# Altium project DVT-Atlas-Driver.PrjPcb
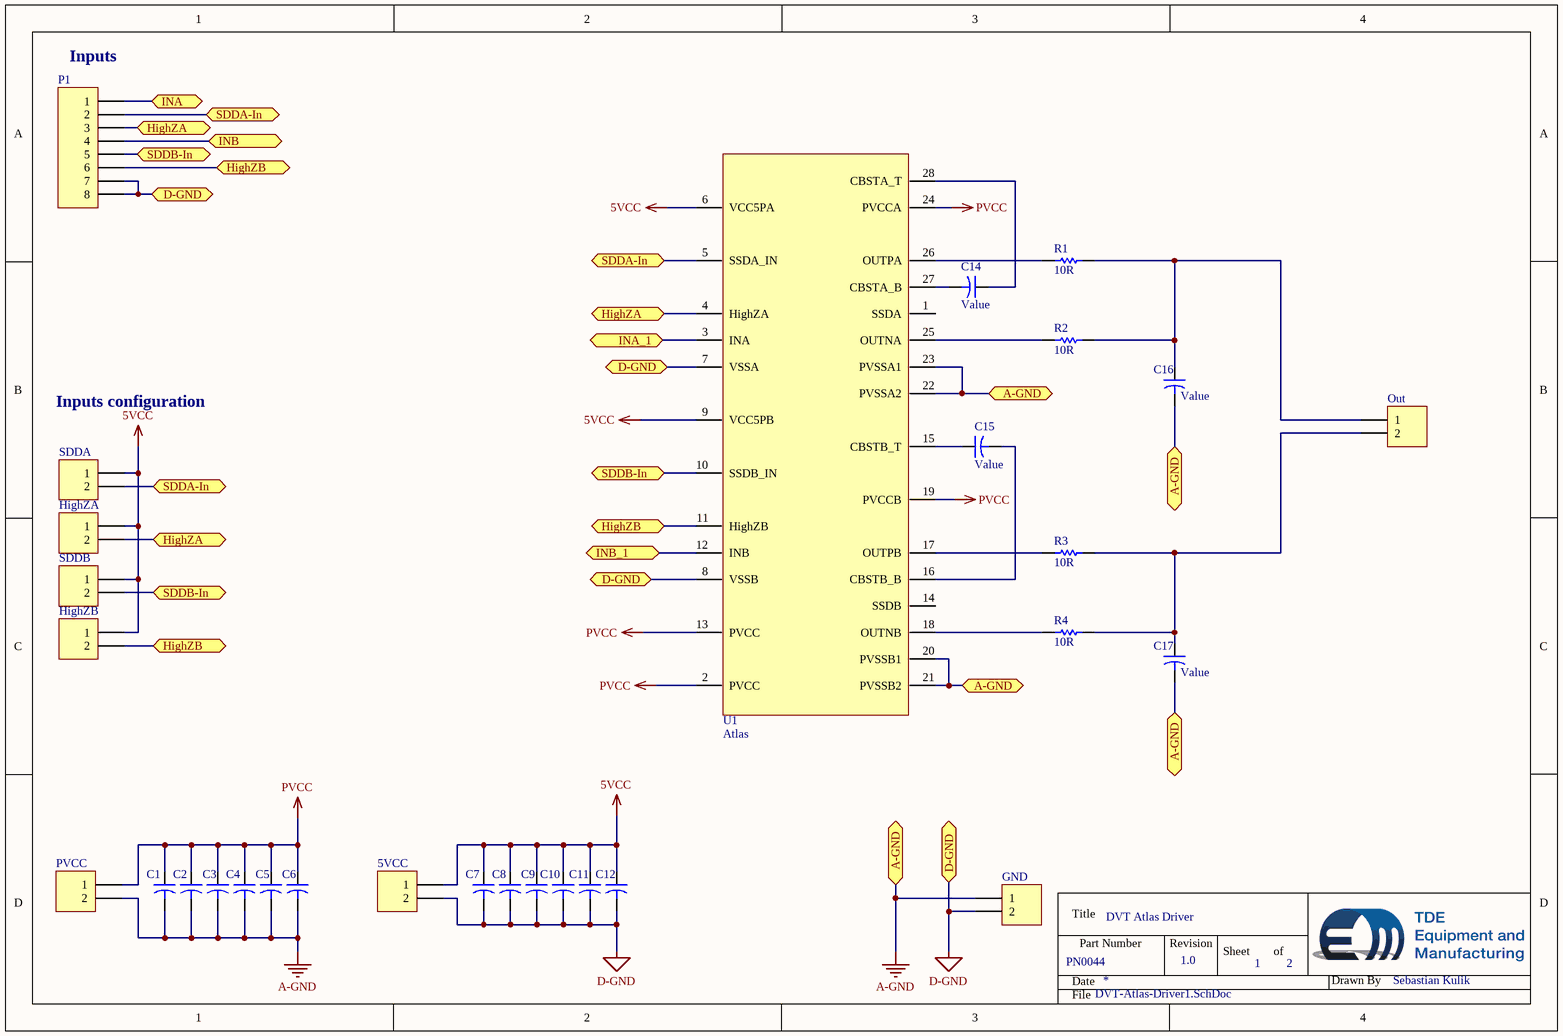
[diagram p0: DVT-Atlas-Driver1.SchDoc]
2 sheets, 36 parts. Net scope: flat (ports and power ports of the same name join across sheets).
Board file: DVT-Atlas-Driver.PcbDoc
Sheets:
  DVT-Atlas-Driver1.SchDoc
  DVT-Atlas-Driver2.SchDoc

## Sheet DVT-Atlas-Driver1.SchDoc: DVT Atlas Driver
size A4; PartNumber: PN0044; Drawn By: Sebastian Kulik

### Parts
5VCC  PHOENIX_1715721  [Phoenix-2-5_08]  (value not drawn)
*  Om  [Om-5mm]  (value not drawn)
+  Om  [Om-5mm]  (value not drawn)
C1  Capacitor-Dummy-THT  [Dummy-10mm]  (value not drawn)
C2  Capacitor-Dummy-THT  [KEMET-C052H]  (value not drawn)
C3  Capacitor-Dummy-THT  [KEMET-C052H]  (value not drawn)
C4  Capacitor-Dummy-THT  [KEMET-C052H]  (value not drawn)
C5  Capacitor-Dummy-THT  [KEMET-C052H]  (value not drawn)
C6  Capacitor-Dummy-THT  [KEMET-C052H]  (value not drawn)
C7  Capacitor-Dummy-THT  [KEMET-C052H]  (value not drawn)
C8  Capacitor-Dummy-THT  [Dummy-10mm]  (value not drawn)
C9  Capacitor-Dummy-THT  [KEMET-C052H]  (value not drawn)
C10  Capacitor-Dummy-THT  [KEMET-C052H]  (value not drawn)
C11  Capacitor-Dummy-THT  [KEMET-C052H]  (value not drawn)
C12  Capacitor-Dummy-THT  [KEMET-C052H]  (value not drawn)
C14  Capacitor-Dummy-THT  [KEMET-C052H]  (value not drawn)
C15  Capacitor-Dummy-THT  [KEMET-C052H]  (value not drawn)
C16  Capacitor-Dummy-THT  [KEMET-C052H]  (value not drawn)
C17  Capacitor-Dummy-THT  [KEMET-C052H]  (value not drawn)
GND  PHOENIX_1715721  [Phoenix-2-5_08]  (value not drawn)
HighZA  Plug_2_180_2.54  [HDR1X2]  (value not drawn)
HighZB  Plug_2_180_2.54  [HDR1X2]  (value not drawn)
Out  PHOENIX_1715721  [Phoenix-2-5_08]  (value not drawn)
P1  Plug_08_2.54  [HDR1X8_2.54]  (value not drawn)
PVCC  PHOENIX_1715721  [Phoenix-2-5_08]  (value not drawn)
R1  value 10R  [Dummy-10mm]  (hidden comment: 10R_10mm-HT-THT)
R2  value 10R  [Dummy-10mm]  (hidden comment: 10R_10mm-HT-THT)
R3  value 10R  [Dummy-10mm]  (hidden comment: 10R_10mm-HT-THT)
R4  value 10R  [Dummy-10mm]  (hidden comment: 10R_10mm-HT-THT)
SDDA  Plug_2_180_2.54  [HDR1X2]  (value not drawn)
SDDB  Plug_2_180_2.54  [HDR1X2]  (value not drawn)
U1  Atlas  [SOIC28]

### Ports
A-GND, D-GND, HighZA, HighZB, INA, INA_1, INB, INB_1, SDDA-In, SDDB-In

### Nets
5VCC: 5VCC.1 C7.1 C8.1 C9.1 C10.1 C11.1 C12.1 HighZA.1 HighZB.1 SDDA.1 SDDB.1 U1.6(VCC5PA) U1.9(VCC5PB)
A-GND: C1.2 C2.2 C3.2 C4.2 C5.2 C6.2 C16.2 C17.2 GND.1 PVCC.2 U1.20(PVSSB1) U1.21(PVSSB2) U1.22(PVSSA2) U1.23(PVSSA1) ; port A-GND
D-GND: 5VCC.2 C7.2 C8.2 C9.2 C10.2 C11.2 C12.2 GND.2 P1.7 P1.8 U1.7(VSSA) U1.8(VSSB) ; port D-GND
PVCC: C1.1 C2.1 C3.1 C4.1 C5.1 C6.1 PVCC.1 U1.2(PVCC) U1.13(PVCC) U1.19(PVCCB) U1.24(PVCCA)
NetC14_1: C14.1 U1.28(CBSTA_T)
NetC14_2: C14.2 U1.27(CBSTA_B)
NetC15_1: C15.1 U1.15(CBSTB_T)
NetC15_2: C15.2 U1.16(CBSTB_B)
NetC16_1: C16.1 Out.1 R1.2 R2.2
NetC17_1: C17.1 Out.2 R3.2 R4.2
NetHighZA_2: HighZA.2 P1.3 U1.4(HighZA) ; port HighZA
NetHighZB_2: HighZB.2 P1.6 U1.11(HighZB) ; port HighZB
NetINA_1: P1.1 ; port INA
NetINA_2: U1.3(INA) ; port INA_1
NetINB_1: P1.4 ; port INB
NetINB_2: U1.12(INB) ; port INB_1
NetP1_2: P1.2 SDDA.2 U1.5(SSDA_IN) ; port SDDA-In
NetP1_5: P1.5 SDDB.2 U1.10(SSDB_IN) ; port SDDB-In
NetR1_1: R1.1 U1.26(OUTPA)
NetR2_1: R2.1 U1.25(OUTNA)
NetR3_1: R3.1 U1.17(OUTPB)
NetR4_1: R4.1 U1.18(OUTNB)

Not connected (* = marked no-connect by the designer): U1 1(SSDA) 14(SSDB)

### Notes on the sheet
- (near P1) Inputs
- Inputs configuration
- 1.0
- 1
- 2
- Title
- Date
- Part Number
- Revision
- Sheet
- of
- Drawn By
- File

### Library data of the parts
5VCC GND Out PVCC = 2Pol_1715721: Phoenix, 2 pol, 5.08mm, 22A, 715721; Deliverer PartNr: 3041529; Deliverer: Farnell; TDE-PN: CON0008; LatestRevisionDate: 02.05.2014; LatestRevisionNote: Re-released for DXP Platform.; Publisher: Sebastian Kulik; Manufacturer PartNr: 1715721; Manufacturer: Phoenix; PackageDescription: Phoenix-2-5_08
HighZA HighZB SDDA SDDB = Plug_2_180_2.54: Plug, 2-Pin; Manufacturer PartNr: 61300211121; Manufacturer: WE; Deliverer PartNr: 828-1581; Deliverer: RS; TDE-PN: CON0010; LatestRevisionDate: 14.05.2014; LatestRevisionNote: Re-released for DXP Platform.; Publisher: Sebastian Kulik; Price: 0.118/5
P1 = Plug_08_2.54: Plug, 08-Pin; Manufacturer PartNr: 61300811121; Manufacturer: WE; Deliverer PartNr: 828-1604; Deliverer: RS; TDE-PN: CON0035; LatestRevisionDate: 11.11.2014; LatestRevisionNote: Re-released for DXP Platform.; Publisher: Sebastian Kulik; Price: 0.346/5
R1-R4 = 10R_10mm-HT-THT: Vishay RN60 series,175°C ,250mW, 1%; Manufacturer PartNr: RN60D10R0FB14; Deliverer PartNr: 830-7558; TDE-PN: R0080; Deliverer: RS; Published: 27.10.2014; Publisher: Sebastian Kulik; PackageDescription: 1206; Manufacturer: Vishay; Price: 0.11/1; Part Description: Vishay RN60 series,175°C ,250mW, 1%
U1 = CHT_TIT3345E_CSOIC28_T: Gate driver, 30V, HT; Deliverer PartNr: CHT-TIT3345E-CSOIC28-T; Manufacturer: CISSOID; Deliverer: Future; TDE-PN: IC0075; Published: 12.05.2016; PackageDescription: SOIC28; Publisher: Sebastian Kulik; Manufacturer PartNr: CHT-TIT3345E-CSOIC28-T; Price: 481.89
C1-C12 C14-C17 = Capacitor-Dummy-THT: Published: 08.12.2015; Part Description: Capacitor-Dummy-THT; Publisher: Sebastian Kulik; PackageDescription: -; Deliverer: -; Deliverer PartNr: -; Manufacturer: -; Manufacturer PartNr: -; TDE-PN: -; Value: Value; Price: *

## Sheet DVT-Atlas-Driver2.SchDoc: DVT Atlas Driver
size A4; PartNumber: PN0044; Drawn By: Sebastian Kulik
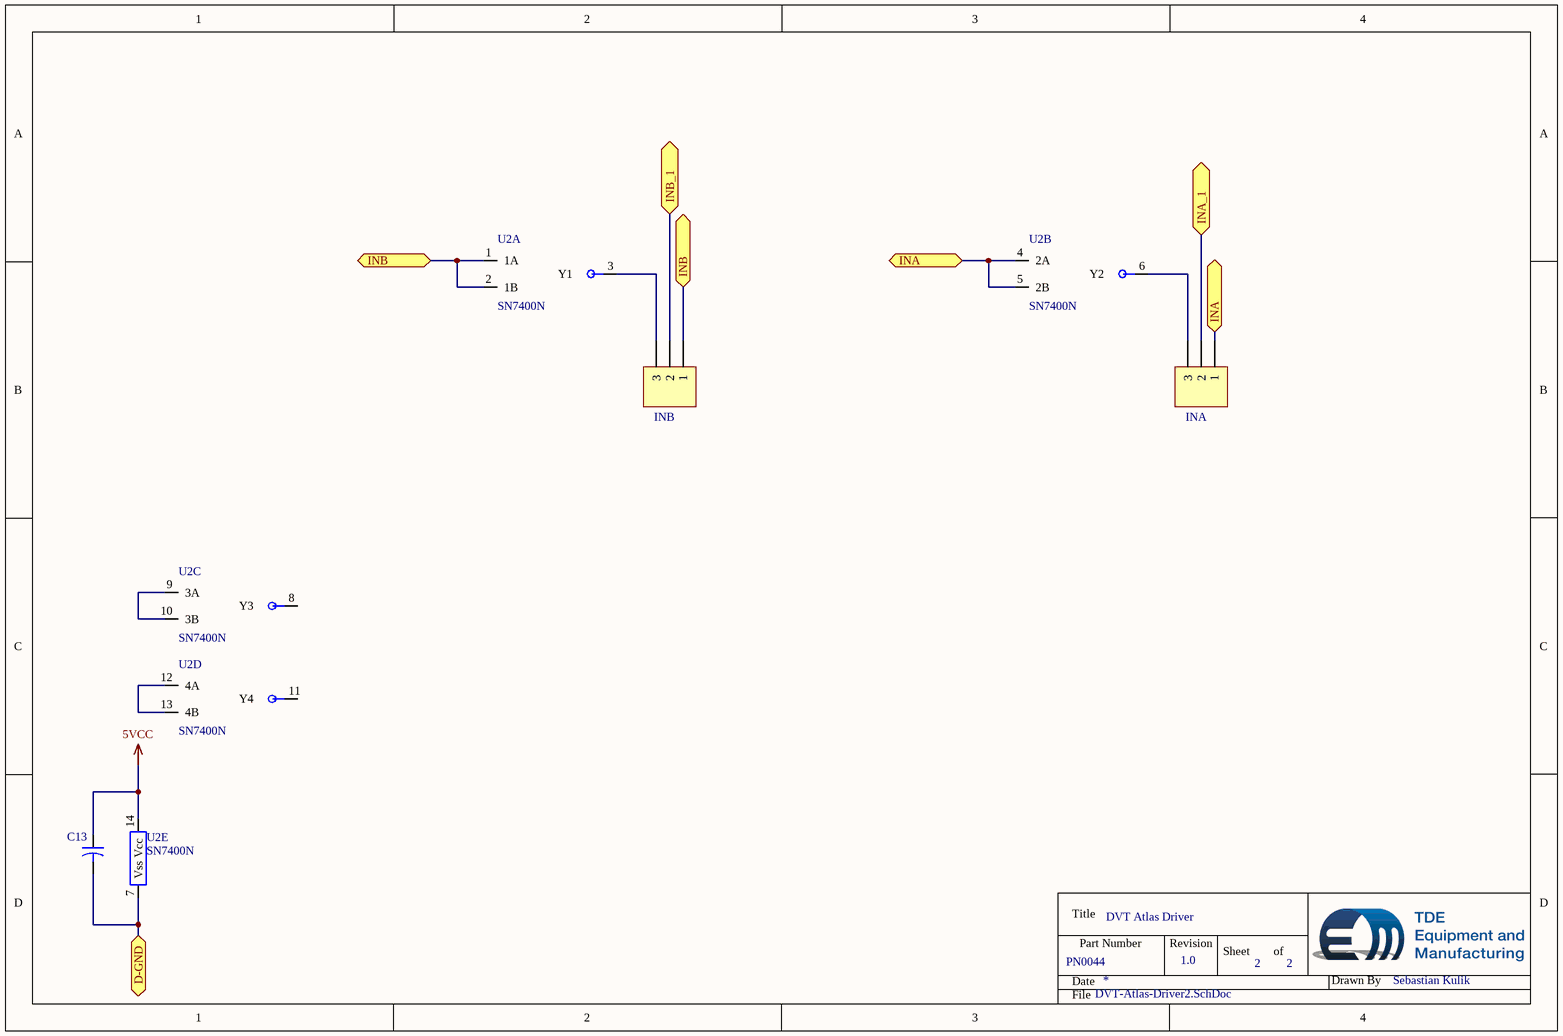
[diagram p1: DVT-Atlas-Driver2.SchDoc]

### Parts
C13  Capacitor-Dummy-THT  [KEMET-C052H]  (value not drawn)
INA  Plug_3_90_2.54  [HDR1X3]  (value not drawn)
INB  Plug_3_90_2.54  [HDR1X3]  (value not drawn)
U2  SN7400N  [DIP-14]  (parts A,B,C,D,E of 5)

### Ports
D-GND, INA, INA_1, INB, INB_1

### Nets
5VCC: C13.1 U2.14(Vcc)
D-GND: C13.2 U2.7(Vss) ; port D-GND
NetINA_1: INA.1 U2.4(2A) U2.5(2B) ; port INA
NetINA_2: INA.2 ; port INA_1
NetINA_3: INA.3 U2.6(Y2)
NetINB_1: INB.1 U2.1(1A) U2.2(1B) ; port INB
NetINB_2: INB.2 ; port INB_1
NetINB_3: INB.3 U2.3(Y1)
NetU2_9: U2.9(3A) U2.10(3B)
NetU2_12: U2.12(4A) U2.13(4B)

Not connected (* = marked no-connect by the designer): U2 8(Y3) 11(Y4)

### Notes on the sheet
- 1.0
- 2
- Title
- Date
- Part Number
- Revision
- Sheet
- of
- Drawn By
- File

### Library data of the parts
INA INB = Plug_3_90_2.54: Plug,-3-Pin; Manufacturer: WE; Manufacturer PartNr: 61300311021; Deliverer PartNr: 828-1585; Deliverer: RS; TDE-PN: CON0011; Publisher: Sebastian Kulik; Price: 0.138/5
U2 = SN7400N: Quad NAND, TTL; Deliverer PartNr: 305-490; Manufacturer: TI; Deliverer: RS; TDE-PN: IC0076; Published: 13.05.2016; PackageDescription: SOIC28; Publisher: Sebastian Kulik; Manufacturer PartNr: SN7400N; Price: 1.45
C13 = Capacitor-Dummy-THT: Published: 08.12.2015; Part Description: Capacitor-Dummy-THT; Publisher: Sebastian Kulik; PackageDescription: -; Deliverer: -; Deliverer PartNr: -; Manufacturer: -; Manufacturer PartNr: -; TDE-PN: -; Value: Value; Price: *

## Nets that join several sheets
5VCC: DVT-Atlas-Driver1 (13 pins), DVT-Atlas-Driver2 (C13.1 U2.14)
D-GND: DVT-Atlas-Driver1 (12 pins), DVT-Atlas-Driver2 (C13.2 U2.7)
NetINA_1: DVT-Atlas-Driver1 (P1.1), DVT-Atlas-Driver2 (INA.1 U2.4 U2.5)
NetINA_2: DVT-Atlas-Driver1 (U1.3), DVT-Atlas-Driver2 (INA.2)
NetINB_1: DVT-Atlas-Driver1 (P1.4), DVT-Atlas-Driver2 (INB.1 U2.1 U2.2)
NetINB_2: DVT-Atlas-Driver1 (U1.12), DVT-Atlas-Driver2 (INB.2)

## Assembly variants
HT-Variant of DVT-Atlas-Driver: alternate parts C1 -> 100nF_50V_THT_HT, C2 -> 100nF_50V_THT_HT, C3 -> 100nF_50V_THT_HT, C4 -> 100nF_50V_THT_HT, C5 -> 100nF_50V_THT_HT, C6 -> 100nF_50V_THT_HT, C7 -> 100nF_50V_THT_HT, C9 -> 100nF_50V_THT_HT, C8 -> 100nF_50V_THT_HT, C10 -> 100nF_50V_THT_HT, C11 -> 100nF_50V_THT_HT, C12 -> 100nF_50V_THT_HT, C13 -> 100nF_50V_THT_HT, C14 -> 47nF_50V_THT_HT, C15 -> 47nF_50V_THT_HT, C16 -> 470pF_200V_THT_HT, C17 -> 470pF_200V_THT_HT